# Altium schematic sheet base de tiempos.SchDoc
size A4
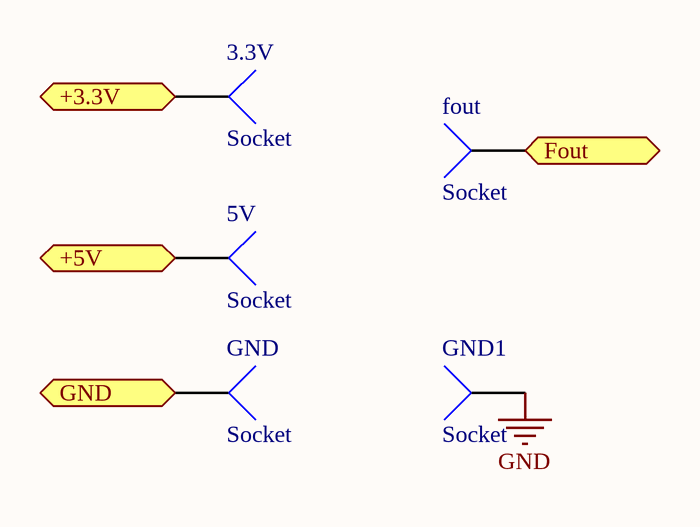
[diagram p0: base de tiempos.SchDoc]

## Parts
3.3V  Socket  [PIN1]
5V  Socket  [PIN1]
fout  Socket  [PIN1]
GND  Socket  [PIN1]
GND1  Socket  [PIN1]

## Ports
+3.3V, +5V, Fout (bidir), GND

## Nets
GND: GND1.1
+3.3V: 3.3V.1 ; port +3.3V
+5V: 5V.1 ; port +5V
Fout: fout.1 ; port Fout
GND: GND.1 ; port GND  [a separate net that carries the same name]

## Library data of the parts
3.3V 5V fout GND GND1 = Socket: LatestRevisionDate: 17-Jul-2002; LatestRevisionNote: Re-released for DXP Platform.; Publisher: Altium Limited